# EAGLE design GB202-CC-from-SF-Base (EAGLE 7.5.0)
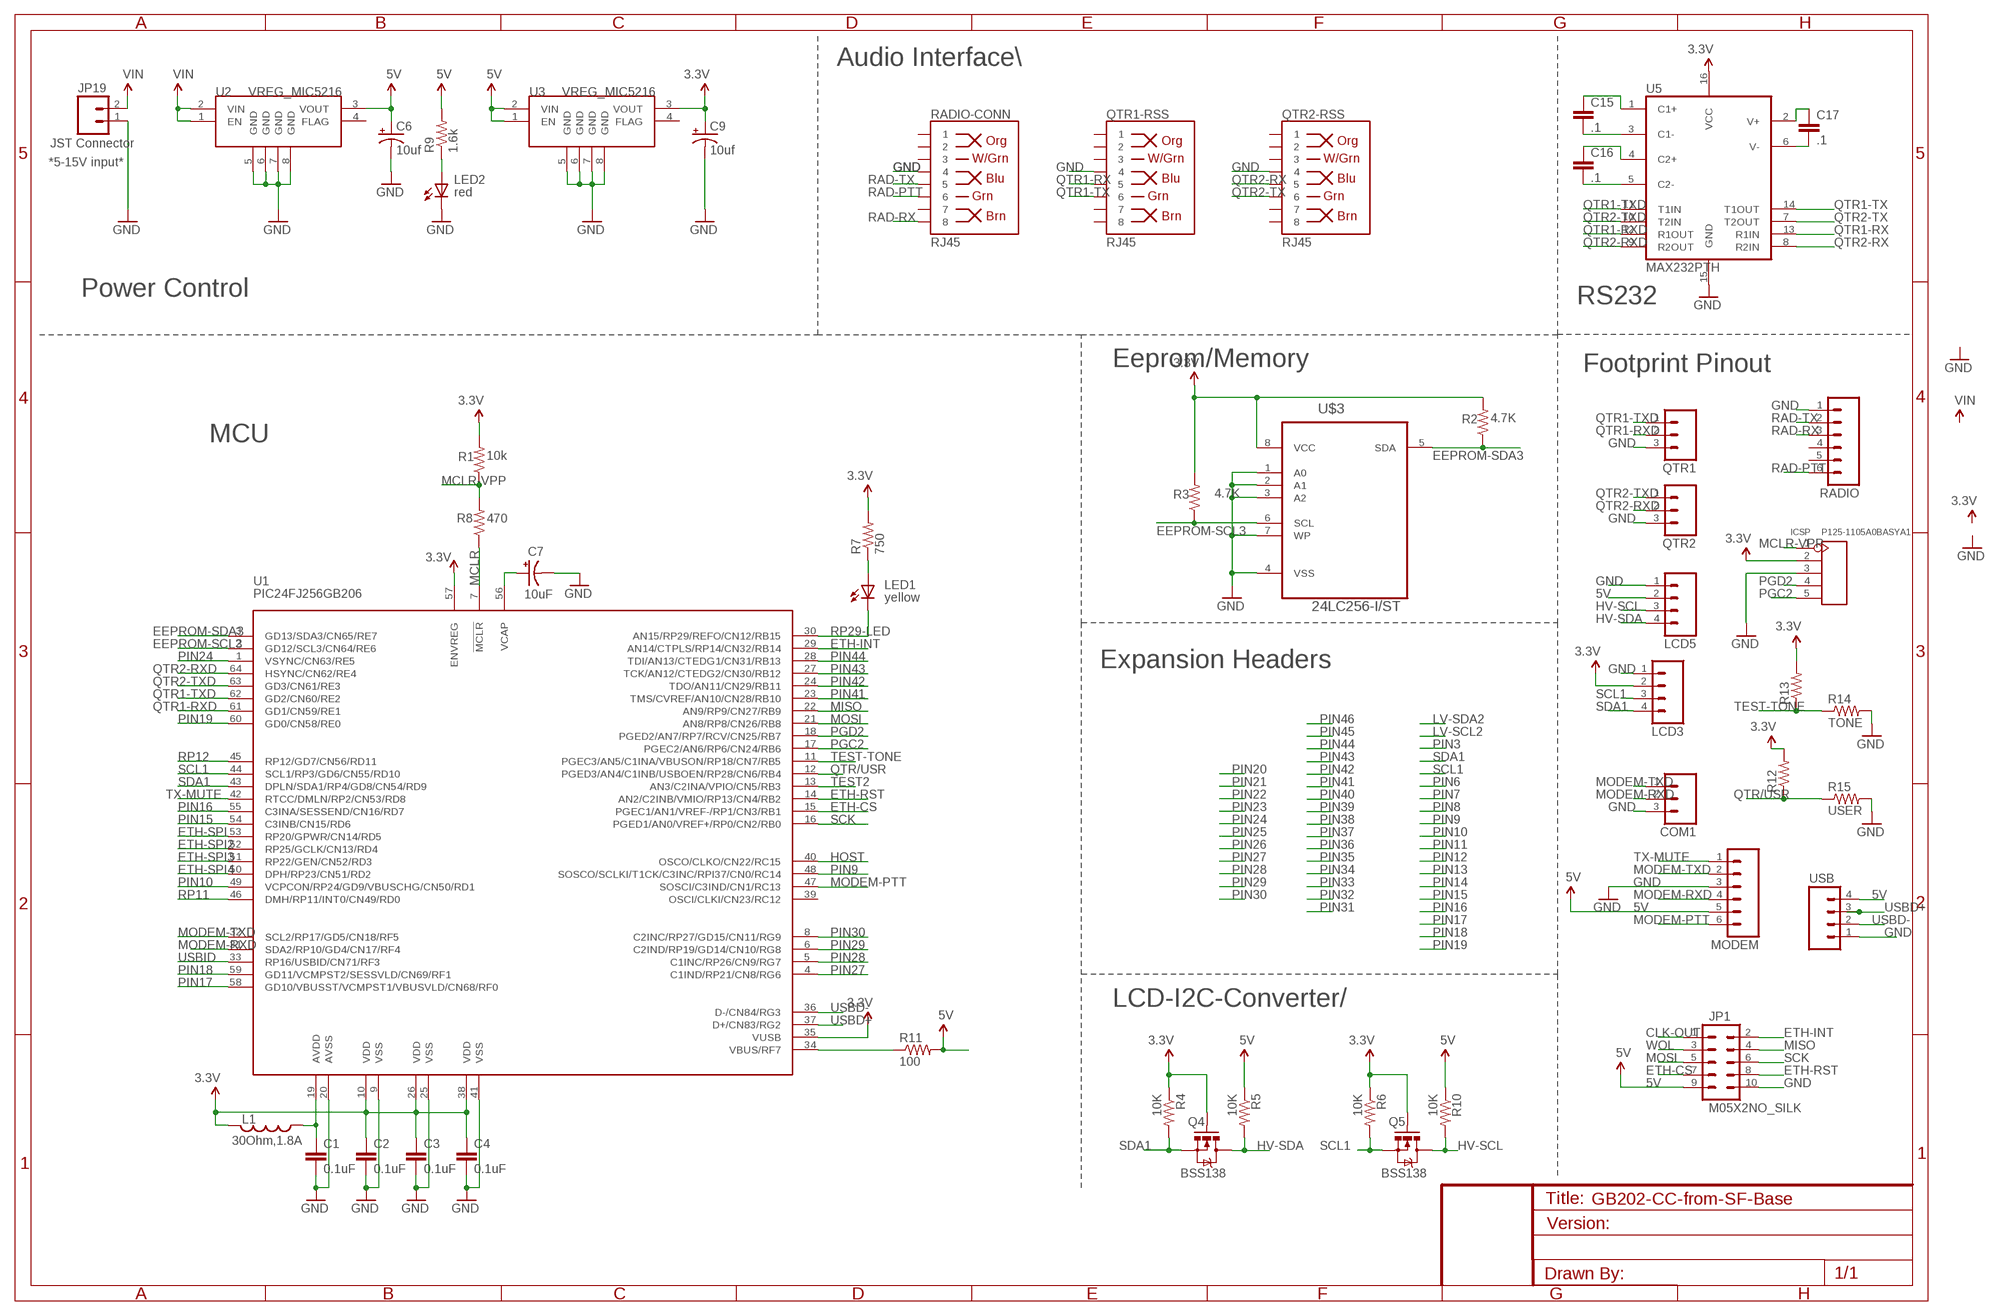
[diagram p0: schematic, sheet 1]

## Parts
C1  0.1uF  CAP0402-CAP  [0402-CAP]
C2  0.1uF  CAP0402-CAP  [0402-CAP]
C3  0.1uF  CAP0402-CAP  [0402-CAP]
C4  0.1uF  CAP0402-CAP  [0402-CAP]
C6  10uf  CAP_POL1206  [EIA3216]
C7  10uF  CAP_POL1206  [EIA3216]
C9  10uf  CAP_POL1206  [EIA3216]
C15  .1  CAPPTH  [CAP-PTH-SMALL]
C16  .1  CAPPTH  [CAP-PTH-SMALL]
C17  .1  CAPPTH  [CAP-PTH-SMALL]
COM1  M031X03_NO_SILK  [1X03_NO_SILK]
ICSP  P125-1105A0BASYA1  DIP-BLACK-MALE-HEADER(5P-2.54)  [H5-2.54]
JP1  M05X2NO_SILK  [2X5_NOSILK]
JP19  JST Connector  M02-JST-2MM-SMT  [JST-2-SMD]
L1  30Ohm,1.8A  INDUCTOR0603  [0603]
LCD3  M04LONGPADS  [1X04_LONGPADS]
LCD5  M04LONGPADS  [1X04_LONGPADS]
LED1  LY L29K-J1K2-26-Z  LED0603  [LED-0603]
LED2  LS L29K-G1J2-1-Z  LED0603  [LED-0603]
MODEM  M06LONGPADS  [1X06_LONGPADS]
Q4  BSS138  MOSFET-NCHANNELSMD  [SOT23-3]
Q5  BSS138  MOSFET-NCHANNELSMD  [SOT23-3]
QTR1  M031X03_NO_SILK  [1X03_NO_SILK]
QTR1-RSS  RJ45  RJ45-8PTH  [RJ45-8]
QTR2  M031X03_NO_SILK  [1X03_NO_SILK]
QTR2-RSS  RJ45  RJ45-8PTH  [RJ45-8]
R1  10k  R-US_R0402  [R0402]
R2  4.7K  R-US_R0402  [R0402]
R3  4.7K  R-US_R0402  [R0402]
R4  10K  RESISTOR0402-RES  [0402-RES]
R5  10K  RESISTOR0603-RES  [0603-RES]
R6  10K  RESISTOR0402-RES  [0402-RES]
R7  750  RESISTOR0603-RES  [0603-RES]
R8  470  R-US_R0402  [R0402]
R9  1.6k  RESISTOR0603-RES  [0603-RES]
R10  10K  RESISTOR0603-RES  [0603-RES]
R11  100  RESISTOR0402-RES  [0402-RES]
R12  R-US_R0402  [R0402]
R13  R-US_R0402  [R0402]
R14  TONE  R-US_R1206  [R1206]
R15  USER  R-US_R1206  [R1206]
RADIO  M06LONGPADS  [1X06_LONGPADS]
RADIO-CONN  RJ45  RJ45-8PTH  [RJ45-8]
U1  PIC24FJ256GB206  PIC24FXXXDAX06  [PIC24FXXX_TQFP64]
U2  VREG_MIC5216  [MSOP8]
U3  VREG_MIC5216  [MSOP8]
U5  MAX232PTH  [DIL16]
U$3  24LC256-I/ST  [SOP65P638X110-8N]
USB  M04PTH  [1X04]

## Nets
3.3V: C2.1 C3.1 C4.1 C9.A(+) ICSP.2 L1.2 LCD3.2 Q4.1(G) Q5.1(G) R1.2 R2.2 R3.2 R4.1 R6.1 R7.2 R12.2 R13.2 U1.10(VDD) U1.26(VDD) U1.35(VUSB) U1.38(VDD) U1.57(ENVREG) U3.3(VOUT) U5.16(VCC) U$3.8(VCC)
5V: C6.A(+) JP1.9 LCD5.2 MODEM.5 R5.1 R9.2 R10.1 R11.2 U2.3(VOUT) U3.1(EN) U3.2(VIN) USB.4
CLK-OUT: JP1.1
EEPROM-SCL3: R3.1 U1.2(GD12/SCL3/CN64/RE6) U$3.6(SCL)
EEPROM-SDA3: R2.1 U1.3(GD13/SDA3/CN65/RE7) U$3.5(SDA)
ETH-CS: JP1.7 U1.15(PGEC1/AN1/VREF-/RP1/CN3/RB1)
ETH-INT: JP1.2 U1.29(AN14/CTPLS/RP14/CN32/RB14)
ETH-RST: JP1.8 U1.14(AN2/C2INB/VMIO/RP13/CN4/RB2)
ETH-SPI: U1.53(RP20/GPWR/CN14/RD5)
ETH-SPI2: U1.52(RP25/GCLK/CN13/RD4)
ETH-SPI3: U1.51(RP22/GEN/CN52/RD3)
ETH-SPI4: U1.50(DPH/RP23/CN51/RD2)
GND: C1.2 C2.2 C3.2 C4.2 C6.C(-) C7.C(-) C9.C(-) COM1.3 ICSP.3 JP1.10 JP19.1 LCD3.1 LCD5.1 LED2.C MODEM.3 QTR1-RSS.4 QTR1.3 QTR2-RSS.4 QTR2.3 R14.2 R15.2 RADIO-CONN.4 RADIO.1 U1.9(VSS) U1.20(AVSS) U1.25(VSS) U1.41(VSS) U2.5(GND) U2.6(GND) U2.7(GND) U2.8(GND) U3.5(GND) U3.6(GND) U3.7(GND) U3.8(GND) U5.15(GND) U$3.1(A0) U$3.2(A1) U$3.3(A2) U$3.4(VSS) U$3.7(WP) USB.1
HOST: U1.40(OSCO/CLKO/CN22/RC15)
HV-SCL: LCD5.3 Q5.3(D) R10.2
HV-SDA: LCD5.4 Q4.3(D) R5.2
MCLR: R8.1 U1.7(!MCLR)
MCLR-VPP: ICSP.1 R1.1 R8.2
MISO: JP1.4 U1.22(AN9/RP9/CN27/RB9)
MODEM-PTT: MODEM.6 U1.47(SOSCI/C3IND/CN1/RC13)
MODEM-RXD: COM1.2 MODEM.4 U1.31(SDA2/RP10/GD4/CN17/RF4)
MODEM-TXD: COM1.1 MODEM.2 U1.32(SCL2/RP17/GD5/CN18/RF5)
MOSI: JP1.5 U1.21(AN8/RP8/CN26/RB8)
N$2: LED1.A R7.1
N$3: LED2.A R9.1
N$5: C7.A(+) U1.56(VCAP)
N$9: C1.1 L1.1 U1.19(AVDD)
N$12: R11.1 U1.34(VBUS/RF7)
N$23: C15.1 U5.1(C1+)
N$25: C15.2 U5.3(C1-)
N$26: C16.1 U5.4(C2+)
N$27: C16.2 U5.5(C2-)
N$28: C17.2 U5.6(V-)
N$29: C17.1 U5.2(V+)
PGC2: ICSP.5 U1.17(PGEC2/AN6/RP6/CN24/RB6)
PGD2: ICSP.4 U1.18(PGED2/AN7/RP7/RCV/CN25/RB7)
PIN9: U1.48(SOSCO/SCLKI/T1CK/C3INC/RPI37/CN0/RC14)
PIN10: U1.49(VCPCON/RP24/GD9/VBUSCHG/CN50/RD1)
PIN15: U1.54(C3INB/CN15/RD6)
PIN16: U1.55(C3INA/SESSEND/CN16/RD7)
PIN17: U1.58(GD10/VBUSST/VCMPST1/VBUSVLD/CN68/RF0)
PIN18: U1.59(GD11/VCMPST2/SESSVLD/CN69/RF1)
PIN19: U1.60(GD0/CN58/RE0)
PIN24: U1.1(VSYNC/CN63/RE5)
PIN27: U1.4(C1IND/RP21/CN8/RG6)
PIN28: U1.5(C1INC/RP26/CN9/RG7)
PIN29: U1.6(C2IND/RP19/GD14/CN10/RG8)
PIN30: U1.8(C2INC/RP27/GD15/CN11/RG9)
PIN41: U1.23(TMS/CVREF/AN10/CN28/RB10)
PIN42: U1.24(TDO/AN11/CN29/RB11)
PIN43: U1.27(TCK/AN12/CTEDG2/CN30/RB12)
PIN44: U1.28(TDI/AN13/CTEDG1/CN31/RB13)
QTR1-RX: QTR1-RSS.5 U5.13(R1IN)
QTR1-RXD: QTR1.2 U1.61(GD1/CN59/RE1) U5.12(R1OUT)
QTR1-TX: QTR1-RSS.6 U5.14(T1OUT)
QTR1-TXD: QTR1.1 U1.62(GD2/CN60/RE2) U5.11(T1IN)
QTR2-RX: QTR2-RSS.5 U5.8(R2IN)
QTR2-RXD: QTR2.2 U1.64(HSYNC/CN62/RE4) U5.9(R2OUT)
QTR2-TX: QTR2-RSS.6 U5.7(T2OUT)
QTR2-TXD: QTR2.1 U1.63(GD3/CN61/RE3) U5.10(T2IN)
QTR/USR: R12.1 R15.1 U1.12(PGED3/AN4/C1INB/USBOEN/RP28/CN6/RB4)
RAD-PTT: RADIO-CONN.6 RADIO.6
RAD-RX: RADIO-CONN.8 RADIO.3
RAD-TX: RADIO-CONN.5 RADIO.2
RP11: U1.46(DMH/RP11/INT0/CN49/RD0)
RP12: U1.45(RP12/GD7/CN56/RD11)
RP29-LED: LED1.C U1.30(AN15/RP29/REFO/CN12/RB15)
SCK: JP1.6 U1.16(PGED1/AN0/VREF+/RP0/CN2/RB0)
SCL1: LCD3.3 Q5.2(S) R6.2 U1.44(SCL1/RP3/GD6/CN55/RD10)
SDA1: LCD3.4 Q4.2(S) R4.2 U1.43(DPLN/SDA1/RP4/GD8/CN54/RD9)
TEST2: U1.13(AN3/C2INA/VPIO/CN5/RB3)
TEST-TONE: R13.1 R14.1 U1.11(PGEC3/AN5/C1INA/VBUSON/RP18/CN7/RB5)
TX-MUTE: MODEM.1 U1.42(RTCC/DMLN/RP2/CN53/RD8)
USBD+: U1.37(D+/CN83/RG2) USB.3
USBD-: U1.36(D-/CN84/RG3) USB.2
USBID: U1.33(RP16/USBID/CN71/RF3)
VIN: JP19.2 U2.1(EN) U2.2(VIN)
WOL: JP1.3
Unconnected: QTR1-RSS.1 QTR1-RSS.2 QTR1-RSS.3 QTR1-RSS.7 QTR1-RSS.8 QTR2-RSS.1 QTR2-RSS.2 QTR2-RSS.3 QTR2-RSS.7 QTR2-RSS.8 RADIO-CONN.1 RADIO-CONN.2 RADIO-CONN.3 RADIO-CONN.7 RADIO.4 RADIO.5 U1.39(OSCI/CLKI/CN23/RC12) U2.4(FLAG) U3.4(FLAG)

## Notes on the sheet
- Audio Interface\
- *5-15V input*
- red
- Power Control
- RS232
- Eeprom/Memory | Footprint Pinout
- MCU
- yellow
- Expansion Headers
- LCD-I2C-Converter/

## Library data of the parts
C1-C4 C15-C17 = SparkFun-Capacitors:CAP: Capacitor Standard 0603 ceramic capacitor, and 0.1" leaded capacitor.
C6 C9 = SparkFun-Capacitors:CAP_POL: Capacitor Polarized These are standard SMD and PTH capacitors. Normally 10uF, 47uF, and 100uF in electrolytic and tantalum varieties. Always verify the external diameter of the through hole cap, it varies with capacity, voltage, and manufacturer. The EIA devices should be standard.
C7 = SparkFun:CAP_POL: Capacitor Polarized These are standard SMD and PTH capacitors. Normally 10uF, 47uF, and 100uF in electrolytic and tantalum varieties. Always verify the external diameter of the through hole cap, it varies with capacity, voltage, and manufacturer. The EIA devices should be standard.
COM1 QTR1 QTR2 = SparkFun-Connectors:M03: Header 3 Standard 3-pin 0.1" header. Use with straight break away headers (SKU : PRT-00116), right angle break away headers (PRT-00553), swiss pins (PRT-00743), machine pins (PRT-00117), and female headers (PRT-00115). Molex polarized connector foot print use with SKU : PRT-08232 with associated crimp pins and housings.
ICSP = Seeed-OPL-Connector:DIP-BLACK-MALE-HEADER(5P-2.54): 320020111; MPN: P125-1105A0BASYA1
JP1 = SparkFun-Connectors:M05X2: Header 5x2 Standard 10-pin dual row 0.1" header. Commonly used with AVR-ISP. Use with Spark Fun Electronics SKU: PRT-00778
JP19 = SparkFun:M02: Header 2 Standard 2-pin 0.1" header. Use with straight break away headers (SKU : PRT-00116), right angle break away headers (PRT-00553), swiss pins (PRT-00743), machine pins (PRT-00117), and female headers (PRT-00115). Molex polarized connector foot print use with SKU : PRT-08233 with associated crimp pins and housings.
L1 = SparkFun-Passives:INDUCTOR: Inductors Basic Inductor/Choke - 0603 and 1206. Footprints are not proven and vary greatly between part numbers. SRN6045- 33uH, 20% 1.4A
LCD3 LCD5 USB = SparkFun-Connectors:M04: Header 4 Standard 4-pin 0.1" header. Use with straight break away headers (SKU : PRT-00116), right angle break away headers (PRT-00553), swiss pins (PRT-00743), machine pins (PRT-00117), and female headers (PRT-00115). Molex polarized connector foot print use with SKU : PRT-08231 with associated crimp pins and housings. 1MM SMD Version SKU: PRT-10208
LED1 = SparkFun-LED:LED: LEDs Standard schematic elements and footprints for 5mm, 3mm, 1206, and 0603 sized LEDs. 5mm - Spark Fun Electronics SKU : COM-00529 (and others)
LED2 = SparkFun:LED: LEDs Standard schematic elements and footprints for 5mm, 3mm, 1206, and 0603 sized LEDs. 5mm - Spark Fun Electronics SKU : COM-00529 (and others)
MODEM RADIO = SparkFun-Connectors:M06: Header 6 Standard 6-pin 0.1" header. Use with straight break away headers (SKU : PRT-00116), right angle break away headers (PRT-00553), swiss pins (PRT-00743), machine pins (PRT-00117), and female headers (PRT-00115). Molex polarized connector foot print use with SKU : PRT-08094 with associated crimp pins and housings. NOTES ON THE VARIANTS LOCK and LOCK_LONGPADS... This footprint was designed to help hold the alignment of a through-hole component (i.e. 6-pin header) while soldering it into place. You may notice that each hole has been shifted either up or down by 0.005 of an inch from it's more standard position (which is a perfectly straight line). This slight alteration caused the pins (the squares in the middle) to touch the edges of the holes. Because they are alternating, it causes a "brace" to hold the component in place. 0.005 has proven to be the perfect amount of "off-center" position when using our standard breakaway headers. Although looks a little odd when you look at the bare footprint, once you have a header in there, the alteration is very hard to notice. Also,if you push a header all the way into place, it is covered up entirely on the bottom side. This idea of altering the position of holes to aid alignment will be further integrated into the Sparkfun Library for other footprints. It can help hold any component with 3 or more connection pins.
Q4 Q5 = SparkFun:MOSFET-NCHANNEL
QTR1-RSS QTR2-RSS RADIO-CONN = SparkFun-Connectors:RJ45-8: RJ45 Jack Simple RJ45, 8-pin connection - connector for common Cat5, Cat5e, and Cat6 Ethernet cables. Footprint not yet proven in production. Connector sku is PRT-00643; Breakout PCB sku is BOB-00716.; PROD_ID: CONN-08506
R1-R3 R8 R12-R15 = rcl:R-US_: RESISTOR, American symbol
R4-R6 R10 R11 = SparkFun:RESISTOR: Resistor Basic schematic elements and footprints for 0603, 1206, and PTH resistors.
R7 R9 = SparkFun-Resistors:RESISTOR: Resistor Basic schematic elements and footprints for 0603, 1206, and PTH resistors.
U1 = SparkFun-DigitalIC:PIC24FXXXDAX06: PIC24FXXXDAX06 PIC24FXXXDA106 / PIC24FXXXDA206
U2 U3 = SparkFun-PowerIC:VREG_MIC5216: 500mA LDO, MSOP8 for better dissipation
U5 = SparkFun-DigitalIC:MAX232: RS232 Transceiver Very common IC. This is generically called 'MAX232', but works with the 3V equivalent MAX3232 generic ICs. Field tested and mother approved. Spark Fun Electronics SKU : COM-00316 (DIP) and COM-00589 (SMD)
U$3 = Microchip_By_element14_Batch_1:24LC256-I/ST: 256K I2C CMOS Serial EEPROM; DESCRIPTION: EEPROM; MPN: 24LC256-I/ST; OC_FARNELL: 1296579; OC_NEWARK: 27C9145; PACKAGE: TSSOP-8; SUPPLIER: Microchip

## Board
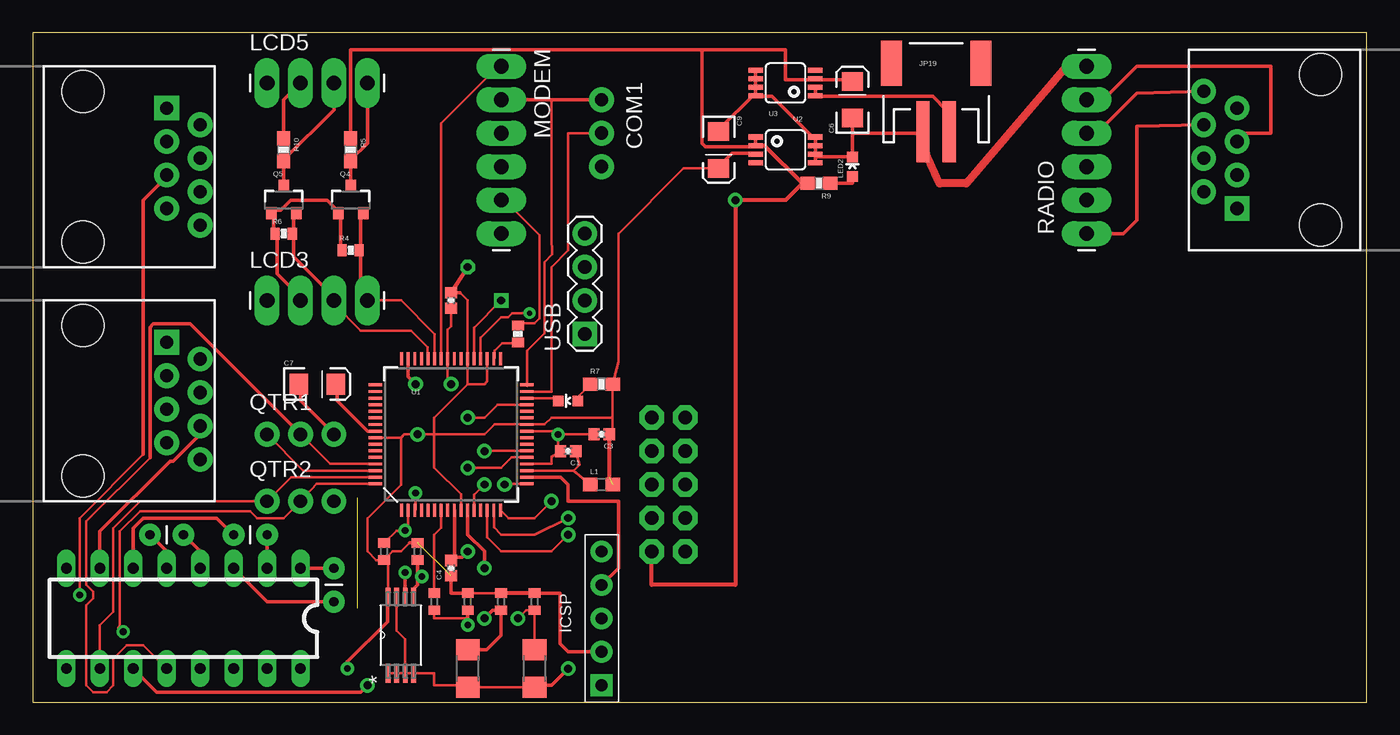
[diagram p1: board, top side]
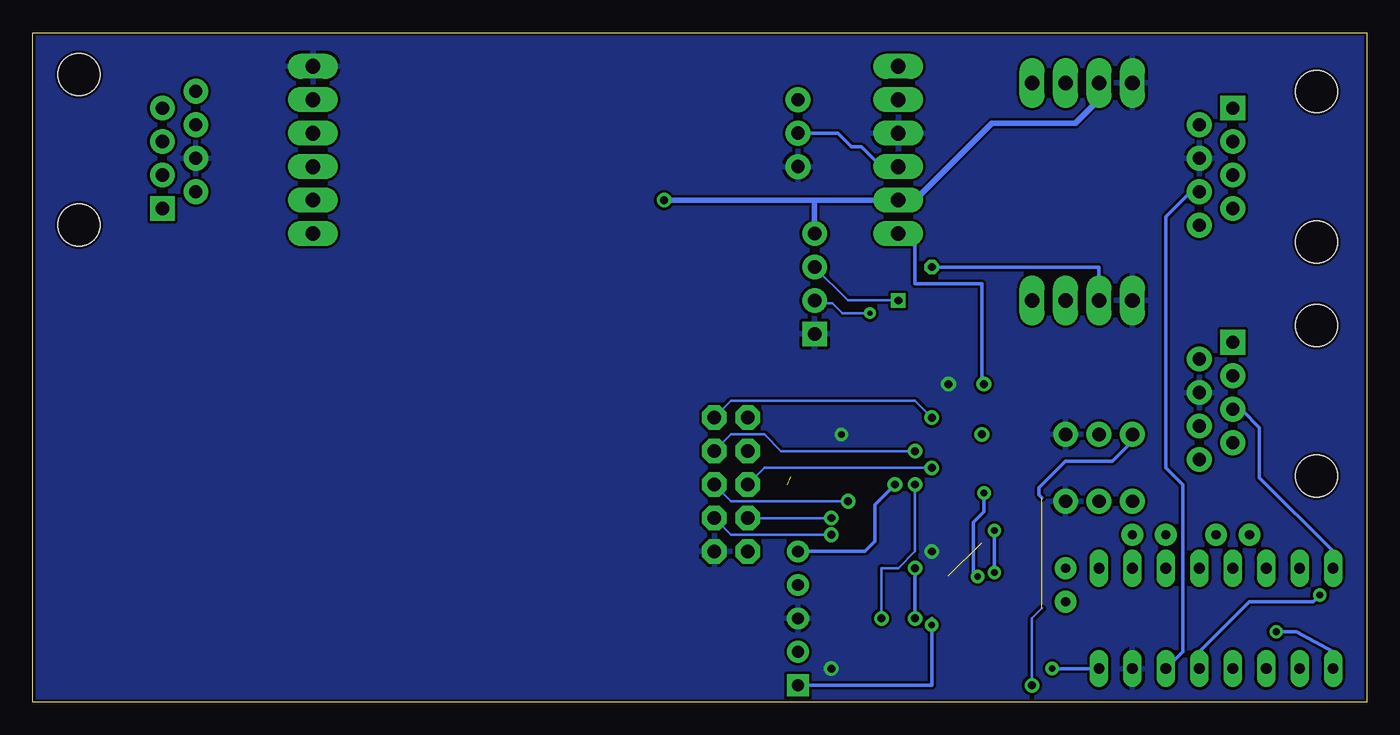
[diagram p2: board, bottom side, seen from below]

Size 101.27 x 50.79 mm. Coordinates in mm from the lower left corner, seen from the top.
Outline: 0,0 101.27,0 101.27,50.79 0,50.79 0,0
Copper layers (1*16): Top 0.035mm / dielectric 1.5mm / Bottom 0.035mm
Design rules "SparkFun-2-layer *": minimum track width 7mil, minimum drill 15mil, track to track 8mil, track to pad 8mil, pad to pad 8mil, via to via 8mil, smd to smd 8mil, copper to edge 8mil, drill to drill 8mil, minimum pad ring 12mil, minimum via ring 10mil, stop-mask expansion 4mil, vias tented up to drill 20mil, thermal gap 10mil

### Footprints (pad centres in the part's own frame; a part is rotated, then mirrored left to right if it is on the bottom)
0402-CAP = smd 0.85 x 0.9: 1 -0.58,0; 2 0.58,0
EIA3216 = smd 1.4 x 1.6: A 1.4,0; C -1.4,0
CAP-PTH-SMALL = drill 0.7 pad 1.651: 1 0,0; 2 2.54,0
1X03_NO_SILK = drill 1.016 pad 1.88: 1 0,0; 2 2.54,0; 3 5.08,0
H5-2.54 = drill 0.889 pad 1.651 square: 1 0,5.08 | drill 0.889 pad 1.651: 2 0,2.54; 3 0,0; 4 0,-2.54; 5 0,-5.08
2X5_NOSILK = drill 1.016 pad 1.88 octagon: 1 -1.27,5.08; 2 1.27,5.08; 3 -1.27,2.54; 4 1.27,2.54; 5 -1.27,0; 6 1.27,0; 7 -1.27,-2.54; 8 1.27,-2.54; 9 -1.27,-5.08; 10 1.27,-5.08
JST-2-SMD = smd 1 x 4.6: 1 -1,-3.7; 2 1,-3.7 | smd 1.6 x 3.4: NC1 -3.4,1.5; NC2 3.4,1.5
0603 = smd 1.1 x 1: 1 -0.85,0; 2 0.85,0
1X04_LONGPADS = drill 1.118 pad 1.88 long: 1 0,0; 2 2.54,0; 3 5.08,0; 4 7.62,0
LED-0603 = smd 0.8 x 0.8: A 0,-0.75; C 0,0.75
1X06_LONGPADS = drill 1.118 pad 1.88 long: 1 0,0; 2 2.54,0; 3 5.08,0; 4 7.62,0; 5 10.16,0; 6 12.7,0
SOT23-3 = smd 0.8 x 0.9: 1 -0.95,-1; 2 0.95,-1; 3 0,1.1
RJ45-8 = drill 1 pad 1.88 square: 1 -4.445,6.35 | drill 1 pad 1.88: 2 -3.175,8.89; 3 -1.905,6.35; 4 -0.635,8.89; 5 0.635,6.35; 6 1.905,8.89; 7 3.175,6.35; 8 4.445,8.89 | hole 3.2: -5.715,0; 5.715,0
R0402 = smd 0.7 x 0.9: 1 -0.65,0; 2 0.65,0
0402-RES = smd 0.7 x 0.9: 1 -0.65,0; 2 0.65,0
0603-RES = smd 1.1 x 1: 1 -0.85,0; 2 0.85,0
R1206 = smd 1.6 x 1.803: 1 -1.422,0; 2 1.422,0
PIC24FXXX_TQFP64 = smd 0.22 x 1: 1 -3.75,-5.75; 2 -3.25,-5.75; 3 -2.75,-5.75; 4 -2.25,-5.75; 5 -1.75,-5.75; 6 -1.25,-5.75; 7 -0.75,-5.75; 8 -0.25,-5.75; 9 0.25,-5.75; 10 0.75,-5.75; 11 1.25,-5.75; 12 1.75,-5.75; 13 2.25,-5.75; 14 2.75,-5.75; 15 3.25,-5.75; 16 3.75,-5.75; 33 3.75,5.75; 34 3.25,5.75; 35 2.75,5.75; 36 2.25,5.75; 37 1.75,5.75; 38 1.25,5.75; 39 0.75,5.75; 40 0.25,5.75; 41 -0.25,5.75; 42 -0.75,5.75; 43 -1.25,5.75; 44 -1.75,5.75; 45 -2.25,5.75; 46 -2.75,5.75; 47 -3.25,5.75; 48 -3.75,5.75 | smd 1 x 0.22: 17 5.75,-3.75; 18 5.75,-3.25; 19 5.75,-2.75; 20 5.75,-2.25; 21 5.75,-1.75; 22 5.75,-1.25; 23 5.75,-0.75; 24 5.75,-0.25; 25 5.75,0.25; 26 5.75,0.75; 27 5.75,1.25; 28 5.75,1.75; 29 5.75,2.25; 30 5.75,2.75; 31 5.75,3.25; 32 5.75,3.75; 49 -5.75,3.75; 50 -5.75,3.25; 51 -5.75,2.75; 52 -5.75,2.25; 53 -5.75,1.75; 54 -5.75,1.25; 55 -5.75,0.75; 56 -5.75,0.25; 57 -5.75,-0.25; 58 -5.75,-0.75; 59 -5.75,-1.25; 60 -5.75,-1.75; 61 -5.75,-2.25; 62 -5.75,-2.75; 63 -5.75,-3.25; 64 -5.75,-3.75
MSOP8 = smd 0.4 x 1.1: 1 -0.975,-2.25; 2 -0.325,-2.25; 3 0.325,-2.25; 4 0.975,-2.25; 5 0.975,2.25; 6 0.325,2.25; 7 -0.325,2.25; 8 -0.975,2.25
DIL16 = drill 0.813 long: 1 -8.89,-3.81; 2 -6.35,-3.81; 3 -3.81,-3.81; 4 -1.27,-3.81; 5 1.27,-3.81; 6 3.81,-3.81; 7 6.35,-3.81; 8 8.89,-3.81; 9 8.89,3.81; 10 6.35,3.81; 11 3.81,3.81; 12 1.27,3.81; 13 -1.27,3.81; 14 -3.81,3.81; 15 -6.35,3.81; 16 -8.89,3.81
SOP65P638X110-8N = smd 1.422 x 0.356: 1 -2.896,0.965; 2 -2.896,0.33; 3 -2.896,-0.33; 4 -2.896,-0.965; 5 2.896,-0.965; 6 2.896,-0.33; 7 2.896,0.33; 8 2.896,0.965
1X04 = drill 1.016 pad 1.88 square: 1 0,0 | drill 1.016 pad 1.88: 2 2.54,0; 3 5.08,0; 4 7.62,0

### Placement (x,y rotation side)
C1  40.64,19.05 180 top
C2  31.75,30.48 270 top
C3  43.18,20.32 180 top
C4  31.75,10.16 90 top
C6  62.23,45.72 90 top
C7  21.59,24.13 0 top
C9  52.07,41.91 270 top
C15  22.86,10.16 270 top
C16  11.43,12.7 180 top
C17  17.78,12.7 180 top
COM1  43.18,45.72 270 top
ICSP  43.18,6.35 180 top
JP1  48.26,16.51 0 top
JP19  68.58,46.99 0 top
L1  43.18,16.51 0 top
LCD3  17.78,30.48 0 top
LCD5  17.78,46.99 0 top
LED1  40.64,22.86 90 top
LED2  62.23,40.64 0 top
MODEM  35.56,48.26 270 top
Q4  24.13,38.1 0 top
Q5  19.05,38.1 0 top
QTR1  17.78,20.32 0 top
QTR1-RSS  3.81,40.64 270 top
QTR2  17.78,15.24 0 top
QTR2-RSS  3.81,22.86 270 top
R1  33.02,7.62 90 top
R2  29.21,11.43 90 top
R3  26.67,11.43 270 top
R4  24.13,34.29 0 top
R5  24.13,41.91 270 top
R6  19.05,35.56 0 top
R7  43.18,24.13 0 top
R8  30.48,7.62 270 top
R9  59.69,39.37 180 top
R10  19.05,41.91 270 top
R11  36.83,27.94 90 top
R12  38.1,7.62 90 top
R13  35.56,7.62 90 top
R14  33.02,2.54 270 top
R15  38.1,2.54 270 top
RADIO  80.01,48.26 270 top
RADIO-CONN  97.79,41.91 90 top
U1  31.75,20.32 0 top
U2  57.15,46.99 90 top
U3  57.15,41.91 270 top
U5  11.43,6.35 180 top
U$3  27.94,5.08 90 top
USB  41.91,27.94 90 top

### Tracks (layer width: path | path; a pad name or v marks a point on that pad's centre or on a via)
3.3V  (via drill 0.51, 0.6)  (2 unrouted)
  Top 0.203: C9.A 49.4,40.51 44.45,35.56 44.45,25.82 R7.2 44.03,21.59 | U$3.8 26.98,10.47 R3.2 | R1.2 R13.2 | U1.10 32.5,15.76 30.48,17.78 30.48,20.32 | 44.03,21.59 44.03,20.59 C3.1 | 44.03,21.59 39.37,21.59 38.85,21.07 U1.26 35.04,21.07 34.29,20.32 30.48,20.32 | 30.48,20.32 v29.21,20.32 28.19,20.32 27.94,20.07 | 27.94,20.07 U1.57 | 33,24.11 U1.38 33.02,26.07 33.02,30.48 32.44,31.06 | 33,24.11 30.48,21.59 30.48,20.32 | R3.2 26.05,10.78 25.4,11.43 25.4,13.97 27.94,16.51 27.94,20.07 | 28.59,12.08 27.94,11.43 27.32,11.43 R3.2 | U1.35 34.5,24.34 34.29,24.13 33.02,24.13 33,24.11
  Top 0.254: R4.1 23.37,34.29 23.37,37.08 Q4.1 23.11,37.34 22.35,38.1 19.56,38.1 18.8,37.34 18.29,37.34 Q5.1 18.29,37.08 18.29,35.56 R6.1 18.54,35.56 18.54,32.51 20.32,30.73 LCD3.2 | v23.88,2.54 23.88,3.05 26.92,6.1 26.92,7.87 U$3.8 | U3.3 54.86,41.66 53.09,41.66 52.07,40.64 C9.A | 32.44,31.06 C2.1 v33.02,33.02 | R12.2 40.02,8.27 40.02,4.43 40.64,3.81 ICSP.2 | R2.2 28.59,12.08 | C4.1 31.75,8.27 R1.2
  Top 0.305: C3.1 43.76,17.09 | R12.2 R13.2
  Bottom 0.254: v23.88,2.54 U5.16 | v33.02,33.02 20.32,33.02 LCD3.2
5V  (via drill 0.6)
  Top 0.178: MODEM.5 35.81,38.1 38.48,35.43 38.48,29.15 38.1,28.77 36.96,28.77 R11.2
  Top 0.203: U3.2 55.55,42.23 | 58.42,39.37 R9.2
  Top 0.254: C6.A 62.23,47.24 59.44,47.24 U2.3 59.18,47.24 57.15,47.24 57.15,49.53 50.8,49.53 | 54.86,42.42 54.86,42.93 U3.1 | 54.86,42.42 54.61,42.16 51.05,42.16 50.8,42.42 50.8,49.53 | 54.86,42.42 U3.2 | R10.1 19.05,45.72 LCD5.2 | 50.8,49.53 24.13,49.53 R5.1
  Top 0.305: 55.55,42.23 58.42,39.37 57.15,38.1 v53.34,38.1 53.34,8.89 46.99,8.89 JP1.9
  Bottom 0.406: LCD5.2 20.32,45.72 22.1,43.94 28.45,43.94 34.29,38.1 MODEM.5 41.91,38.1 | 41.91,38.1 v53.34,38.1 | USB.4 41.91,38.1
EEPROM-SCL3  (via drill 0.51)
  Top 0.203: U1.2 28.5,13.02 v28.26,13.02 27.61,13.02 R3.1
  Top 0.254: 26.67,12.19 R3.1 | v28.26,9.84 28.26,8.1 U$3.6
  Bottom 0.254: v28.26,13.02 v28.26,9.84
EEPROM-SDA3  (via drill 0.51)
  Top 0.203: v29.05,15.88 29.05,14.61 29.02,14.57 U1.3
  Top 0.254: U$3.5 28.91,8.59 29.21,8.89 29.21,9.53 | 29.21,9.53 R2.1 | 29.21,9.53 v29.53,9.53
  Bottom 0.254: v29.05,15.88 29.05,14.45 29.84,13.65 29.84,9.84 v29.53,9.53
ETH-CS  (via drill 0.6)
  Top 0.203: U1.15 35,13.26 35.56,12.7 38.1,12.7 v40.64,13.97
  Bottom 0.203: JP1.7 v40.64,13.97
ETH-INT  (via drill 0.6)
  Top 0.203: U1.29 35.27,22.57 34.29,21.59 v33.02,21.59
  Bottom 0.203: JP1.2 48.26,22.86 34.29,22.86 v33.02,21.59
ETH-RST  (via drill 0.6)
  Top 0.203: U1.14 34.5,12.49 35.56,11.43 39.37,11.43 v40.64,12.7
  Bottom 0.203: JP1.8 48.26,12.7 v40.64,12.7
GND  (via drill 0.51, 0.6)
  Top 0.203: v39.88,20.32 39.63,20.57 U1.25 37.08,20.57 | U1.20 39.37,18.07 39.37,18.63 C1.2 39.88,19.14 v39.88,20.32 | U$3.1 U$3.2 U$3.3 | U$3.3 U$3.4 30.48,2.18 30.48,1.27 33.02,1.27 R14.2 R15.2 | U$3.7 27.61,5.41 28.27,4.75 U$3.3 | C3.2 v39.88,20.32 | C2.2 31.75,28.52 31.5,28.27 U1.41 31.5,24.38 v31.75,24.13
  Top 0.254: 54.86,46.23 54.86,46.48 U2.7 54.86,46.74 54.86,47.24 U2.6 54.86,47.5 54.86,48.01 U2.5 | 54.86,46.23 54.86,45.97 U2.8 55.12,45.97 56.13,45.97 59.18,42.93 U3.8 59.44,42.93 59.44,42.42 U3.7 59.44,42.16 59.44,41.66 U3.6 59.44,41.4 | 54.86,46.23 52.07,43.43 C9.C | 59.44,41.4 62.23,41.4 LED2.C 62.23,43.18 | 59.44,41.4 59.44,40.89 U3.5 | 62.23,43.18 C6.C | 62.23,43.18 67.56,43.18 JP19.1 67.82,43.18 67.82,41.66 | QTR1.3 20.32,22.86 20.32,24.13 C7.C | 38.1,1.27 R15.2 | 38.1,1.78 38.1,1.27 | 38.1,1.27 39.37,1.27 v40.64,2.54 | U1.9 32,10.99 | 32,10.99 C4.2 | 32,10.99 32.58,10.99 v33.02,11.43
  Top 0.61: 67.82,41.66 68.83,39.37 70.87,39.37 78.49,48.26 RADIO.1
  pour Bottom: 0,50.8 0,0 101.6,0 101.6,50.8
HV-SCL
  Top 0.254: Q5.3 R10.2 19.05,41.15 22.86,44.96 LCD5.3
HV-SDA
  Top 0.254: Q4.3 R5.2 24.13,41.15 25.4,42.42 LCD5.4
MCLR
  Top 0.203: U1.7 31,13.22 30.48,12.7 R8.1
MCLR-VPP  (via drill 0.51)
  Top 0.203: 33.02,6.35 30.48,6.35 R8.2
  Top 0.254: R1.1 33.02,6.35 v33.02,5.84
  Bottom 0.254: ICSP.1 33.02,1.27 v33.02,5.84 33.02,6.35
MISO  (via drill 0.6)
  Top 0.203: U1.22 34.31,19.07
  Top 0.254: v34.29,19.05 34.31,19.07
  Bottom 0.203: JP1.4 48.26,20.32 45.72,20.32 44.45,19.05 v34.29,19.05
MODEM-PTT  (via drill 0.6)
  Top 0.254: U1.47 28.5,24.69 v29.06,24.13
  Bottom 0.254: MODEM.6 34.29,35.56 34.29,31.75 29.21,31.75 29.21,24.13 v29.06,24.13
MODEM-RXD
  Top 0.203: U1.31 39.37,23.57 39.37,33.02 40.64,34.29 40.64,43.18 COM1.2
  Bottom 0.254: MODEM.4 36.83,40.64 38.35,42.16 39.12,42.16 40.13,43.18 COM1.2
MODEM-TXD
  Top 0.178: U1.32 37.53,24 37.53,26.67 38.86,28 38.86,33.4 39.43,33.97 39.37,35.31
  Top 0.203: 39.37,45.72 39.37,35.31
  Top 0.254: MODEM.2 39.37,45.72 COM1.1
MOSI  (via drill 0.6)
  Top 0.203: U1.21 36.35,18.57 35.56,17.78 v33.02,17.78
  Bottom 0.203: v33.02,17.78 45.72,17.78 JP1.5
N$2
  Top 0.203: LED1.A 41.39,23.19 R7.1
N$3
  Top 0.254: R9.1 62.23,39.37 LED2.A
N$5
  Top 0.254: U1.56 25.91,20.57 25.4,20.57 23.11,22.86 23.11,24.13 C7.A
N$9
  Top 0.203: U1.19 41.06,17.57 | 41.06,17.57 L1.1 | C1.1 41.49,18 41.06,17.57
N$12
  Top 0.178: R11.1 36.77,27.24 35.62,27.24 35.05,26.67 35.05,26.1 U1.34
N$23
  Top 0.254: C15.1 U5.1
N$25
  Top 0.254: U5.3 17.78,7.62 C15.2
N$26
  Top 0.254: U5.4 12.7,11.43 C16.1
N$27
  Top 0.254: U5.5 10.16,11.43 C16.2
N$28
  Top 0.254: U5.6 7.62,13.21 8.38,13.97 13.97,13.97 C17.2
N$29
  Top 0.254: C17.1 U5.2
PGC2  (via drill 0.6)
  Top 0.203: U1.17 35.87,16.57
  Top 0.254: 35.87,16.57 v35.81,16.51
  Bottom 0.254: v35.81,16.51 37.34,14.99 37.34,12.19 38.1,11.43 ICSP.5
PGD2
  Top 0.254: U1.18 40.08,17.07 40.64,16.51 40.64,15.24 44.45,15.24 44.45,10.16 ICSP.4
QTR1-RX  (via drill 0.51)
  Top 0.203: v3.56,8.13 3.56,13.97 8.38,18.8
  Top 0.254: 8.38,18.8 8.38,38.1 10.16,39.88 QTR1-RSS.5
  Bottom 0.254: U5.13 12.7,3.81 8.89,7.62 4.06,7.62 v3.56,8.13
QTR1-RXD
  Top 0.203: U1.61 22.57,18.07 QTR1.2 | U5.12 8.38,4.32 7.11,4.32 6.1,3.3 6.1,1.27 5.59,0.76 4.57,0.76 4.06,1.27 4.06,7.37 4.57,7.87 4.57,8.38 4.06,8.89 4.06,13.72 8.89,18.54
  Top 0.254: 8.89,18.54 8.89,28.45 9.14,28.7 11.94,28.7 QTR1.2
QTR1-TX
  Bottom 0.254: QTR1-RSS.6 13.34,38.73 15.24,36.83 15.24,17.78 13.97,16.51 13.97,3.81 U5.14
QTR1-TXD  (via drill 0.6)  (1 unrouted)
  Top 0.203: U1.62 20.53,17.57 QTR1.1
  Top 0.254: U5.11 9.4,0.76 24.89,0.76 v25.4,1.27
  Bottom 0.203: v25.4,1.27 25.4,6.35 24.64,7.11
  Bottom 0.254: 24.64,15.49 24.89,15.75 24.89,16.26 22.86,18.29 19.3,18.29 17.78,19.81 QTR1.1
QTR2-RX
  Bottom 0.254: U5.8 2.54,11.43 8.13,17.02 8.13,20.83 9.4,22.1 10.16,22.1 QTR2-RSS.5
QTR2-RXD  (via drill 0.51)
  Top 0.203: 6.6,5.59 6.6,12.95 8.13,14.48 16.51,14.48 17.02,13.97 19.05,13.97 QTR2.2 21.53,16.57 U1.64
  Top 0.406: 6.6,5.59 v6.86,5.33
  Bottom 0.254: U5.9 2.54,3.81 5.33,5.33 v6.86,5.33
QTR2-TX
  Top 0.254: U5.7 5.08,12.95 10.41,18.29 10.67,18.29 12.7,20.32 QTR2-RSS.6
QTR2-TXD
  Top 0.203: U5.10 5.08,5.84 6.1,6.86 6.1,13.21 8.13,15.24 QTR2.1 19.61,17.07 U1.63
QTR/USR  (via drill 0.6)
  Top 0.203: R15.1 R12.1 37.45,6.97 v36.83,6.35 | v34.29,16.51 33.5,15.72 U1.12
  Bottom 0.203: v36.83,6.35 36.83,10.16 35.56,10.16 34.29,11.43 v34.29,16.51
RAD-PTT
  Top 0.254: RADIO.6 82.8,35.56 83.82,36.58 83.82,43.69 RADIO-CONN.6
RAD-RX
  Top 0.254: RADIO.3 80.77,43.18 83.82,46.23 RADIO-CONN.8
RAD-TX
  Top 0.254: RADIO.2 81.28,45.72 83.82,48.26 93.98,48.26 93.98,43.18 92.08,43.18 RADIO-CONN.5
RP29-LED
  Top 0.203: U1.30 39.68,23.07 LED1.C
SCK  (via drill 0.6)
  Top 0.203: U1.16 36.1,13.97 38.1,13.97 v39.37,15.24
  Bottom 0.203: JP1.6 48.26,15.24 v39.37,15.24
SCL1
  Top 0.203: 22.86,30.23 24.89,28.19 28.7,28.19 29.97,26.92 29.97,26.16 U1.44
  Top 0.254: 19.81,35.56 19.81,37.08 Q5.2 | 22.86,30.23 LCD3.3 22.86,30.73 19.81,33.78 19.81,35.56 | 19.81,35.56 R6.2
SDA1
  Top 0.203: U1.43 30.5,27.92 27.94,30.48 LCD3.4 24.89,30.99
  Top 0.254: 24.89,34.29 24.89,37.08 Q4.2 | 24.89,30.99 24.89,34.29 | 24.89,34.29 R4.2
TEST-TONE  (via drill 0.6)
  Top 0.203: 33.02,3.81 R14.1
  Top 0.254: R14.1 34.44,3.96 35.56,5.08 R13.1 34.91,6.97 v34.29,6.35 | v34.29,10.16 34.29,11.43 33.02,12.7 33.02,13.97 33,13.99 U1.11
  Bottom 0.254: v34.29,6.35 v34.29,10.16
TX-MUTE
  Top 0.203: 30.99,26.16 30.99,43.94 35.31,48.26 MODEM.1
  Top 0.254: 30.99,26.16 U1.42
USBD+  (via drill 0.6)
  Top 0.203: U1.37 33.5,28.42 v35.56,30.48
  Bottom 0.203: v35.56,30.48 39.37,30.48 USB.3
USBD-  (via drill 0.38)
  Top 0.178: v37.72,29.53 36.39,29.53
  Top 0.203: U1.36 34,27.65 35.56,29.21 36.07,29.21 36.39,29.53
  Bottom 0.178: v37.72,29.53 39.81,29.53 40.58,30.29 41.72,30.29 USB.2
VIN
  Top 0.254: 59.44,45.97 59.44,46.48 U2.2 | 59.44,45.97 68.33,45.97 69.34,44.96 69.34,43.43 JP19.2 | 59.44,45.97 U2.1